# Altium schematic sheet 1.3英寸液晶电路.SchDoc
size A4
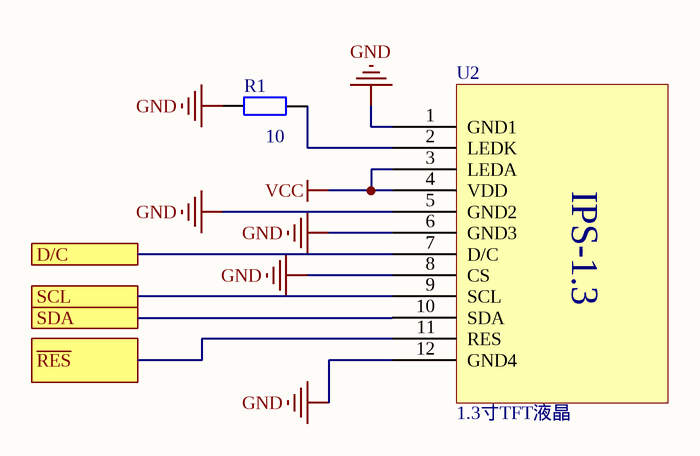
[diagram p0: 1.3英寸液晶电路.SchDoc]

## Parts
R1  value 10  [6-0805_N]  (hidden comment: Res2)
U2  1.3寸TFT液晶  [1.3-TFT-TPS]

## Ports
D/C, SCL, SDA, ~{RES}

## Nets
GND: R1.1 U2.1(GND1) U2.5(GND2) U2.6(GND3) U2.8(CS) U2.12(GND4)
VCC: U2.3(LEDA) U2.4(VDD)
D/C: U2.7(D/C) ; port D/C
~{RES}: U2.11(RES) ; port ~{RES}
SCL: U2.9(SCL) ; port SCL
SDA: U2.10(SDA) ; port SDA
NetR1_2: R1.2 U2.2(LEDK)

## Notes on the sheet
- (in symbol 1.3寸TFT液晶) IPS-1.3

## Library data of the parts
R1 = Res2: Resistor; Published: 8-Jun-2000; LatestRevisionDate: 17-Jul-2002; LatestRevisionNote: Re-released for DXP Platform.; PackageReference: AXIAL-0.4; Publisher: Altium Limited; PackageDescription: Axial Device, Thru-Hole; 2 Leads; 0.4 in Pin Spacing